# EAGLE design CO2_Shield (EAGLE 7.6.0)
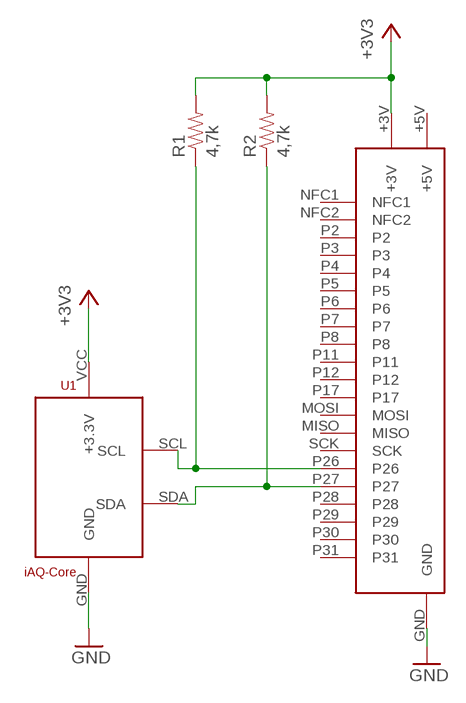
[diagram p0: schematic, sheet 1]

## Parts
R1  4,7k  510OHM1/4W1%(0805)  [0805]
R2  4,7k  510OHM1/4W1%(0805)  [0805]
U1  iAQ-Core  IAQ-CORE  [IAQ-CORE]
U$1  EE02_SHIELD_HEADERSHIELD  [EE02_SHIELD_HEADER]

## Nets
+3V3: R1.2 R2.2 U1.VCC(+3.3V) U$1.+3V
GND: U1.GND U$1.GND
N$1: R2.1 U1.SDA U$1.P27
N$2: R1.1 U1.SCL U$1.P26
Unconnected: U$1.+5V U$1.MISO U$1.MOSI U$1.NFC1 U$1.NFC2 U$1.P2 U$1.P3 U$1.P4 U$1.P5 U$1.P6 U$1.P7 U$1.P8 U$1.P11 U$1.P12 U$1.P17 U$1.P28 U$1.P29 U$1.P30 U$1.P31 U$1.SCK

## Library data of the parts
R1 R2 = EE:510OHM1/4W1%(0805): 510 Ohm; VALUE: 510 ohm
U1 = EE:IAQ-CORE
U$1 = EE:EE02_SHIELD_HEADER

## Board
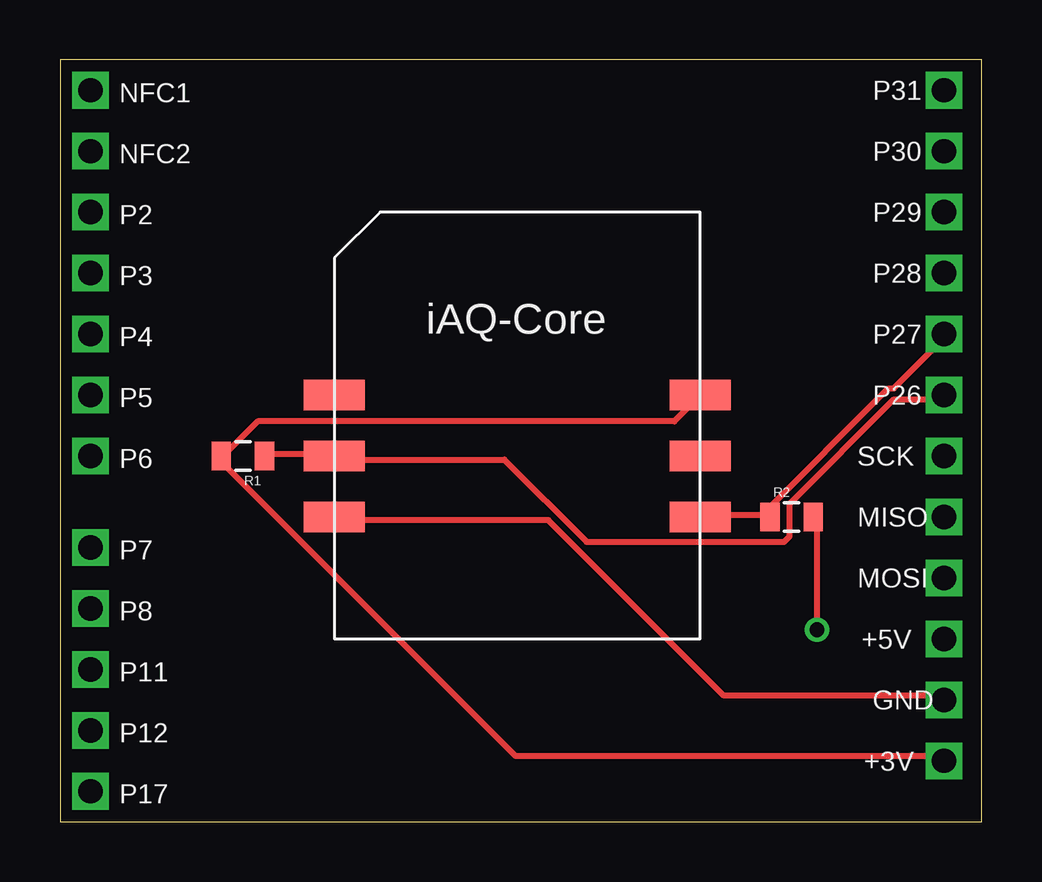
[diagram p1: board, top side]
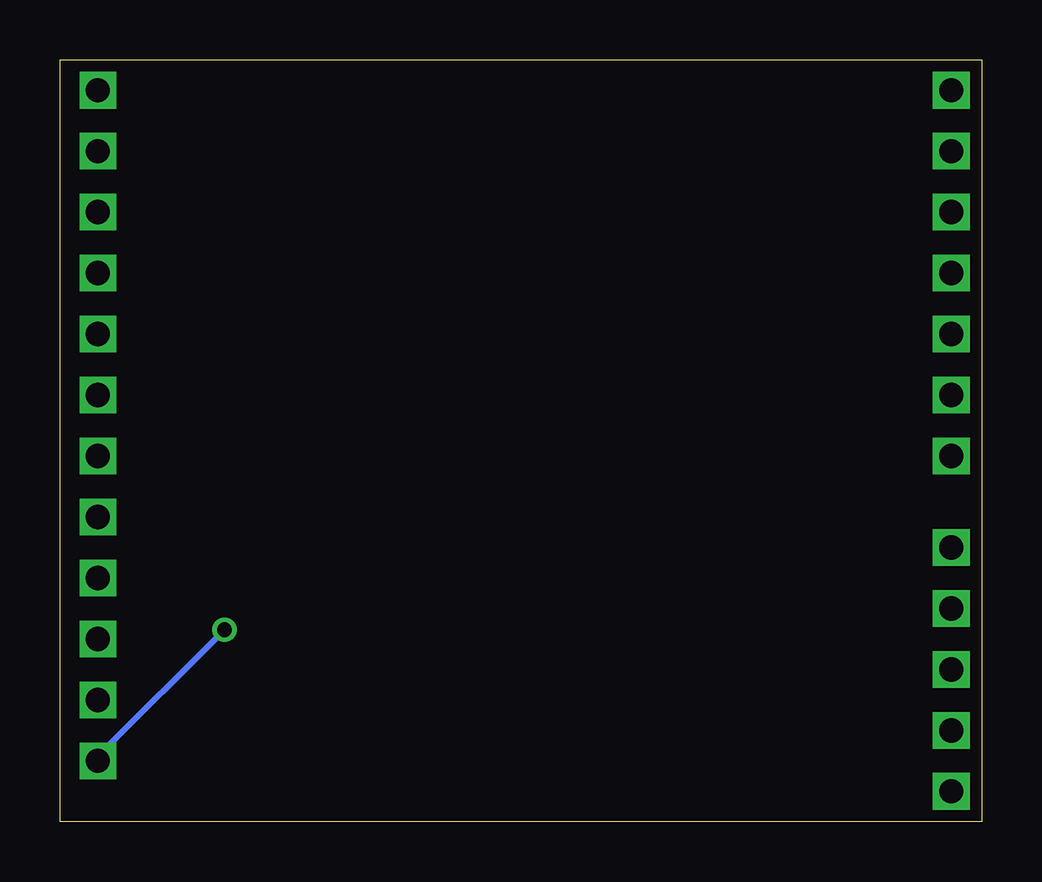
[diagram p2: board, bottom side, seen from below]

Size 38.41 x 31.74 mm. Coordinates in mm from the lower left corner, seen from the top.
Outline: 0,0 38.41,0 38.41,31.74 0,31.74 0,0
Copper layers (1*16): Top 0.035mm / dielectric 1.5mm / Bottom 0.035mm
Design rules "default": minimum track width 10mil, minimum drill 24mil, track to track 8mil, track to pad 8mil, pad to pad 8mil, via to via 8mil, smd to smd 8mil, copper to edge 40mil, drill to drill 8mil, minimum pad ring 10mil, minimum via ring 8mil, stop-mask expansion 4mil, vias tented up to drill 0mil, thermal gap 10mil

### Footprints (pad centres in the part's own frame; a part is rotated, then mirrored left to right if it is on the bottom)
0805 = smd 0.8 x 1.2: 1 -0.9,0; 2 0.9,0
IAQ-CORE = smd 2.54 x 1.27: GND -7.62,-3.81; NC -7.62,1.27; NC$2 7.62,-1.27; SCL -7.62,-1.27; SDA 7.62,-3.81; VCC 7.62,1.27
EE02_SHIELD_HEADER = drill 1.016 square: +3V 35.56,2.54; +5V 35.56,7.62; GND 35.56,5.08; MISO 35.56,12.7; MOSI 35.56,10.16; NFC1 0,30.48; NFC2 0,27.94; P2 0,25.4; P3 0,22.86; P4 0,20.32; P5 0,17.78; P6 0,15.24; P7 0,11.43; P8 0,8.89; P11 0,6.35; P12 0,3.81; P17 0,1.27; P26 35.56,17.78; P27 35.56,20.32; P28 35.56,22.86; P29 35.56,25.4; P30 35.56,27.94; P31 35.56,30.48; SCK 35.56,15.24

### Placement (x,y rotation side)
R1  7.62,15.24 180 top
R2  30.48,12.7 0 top
U1  19.05,16.51 0 top
U$1  1.27,0 0 top

### Tracks (layer width: path | path; a pad name or v marks a point on that pad's centre or on a via)
+3V3  (via drill 0.61)
  Top 0.254: v31.55,8 31.55,12.57 R2.2 | U1.VCC 26.52,17.6 25.6,16.69 8.23,16.69 6.86,15.32 R1.2 6.63,15.09 18.97,2.74 36.8,2.74 U$1.+3V
  Bottom 0.254: v31.55,8 36.8,2.74 U$1.+3V
GND
  Top 0.254: U1.GND 11.43,12.57 20.34,12.57 27.66,5.26 36.8,5.26 U$1.GND
N$1
  Top 0.254: 29.26,12.8 26.75,12.8 U1.SDA | 29.26,12.8 29.49,12.8 R2.1 29.26,12.8 | 29.26,12.8 34.52,18.06 34.75,18.06 36.8,20.12 U$1.P27
N$2
  Top 0.254: R1.1 8.69,15.32 11.43,15.32 U1.SCL 11.43,15.09 18.52,15.09 21.95,11.66 30.18,11.66 30.4,11.89 30.4,13.26 34.75,17.6 36.8,17.6 U$1.P26